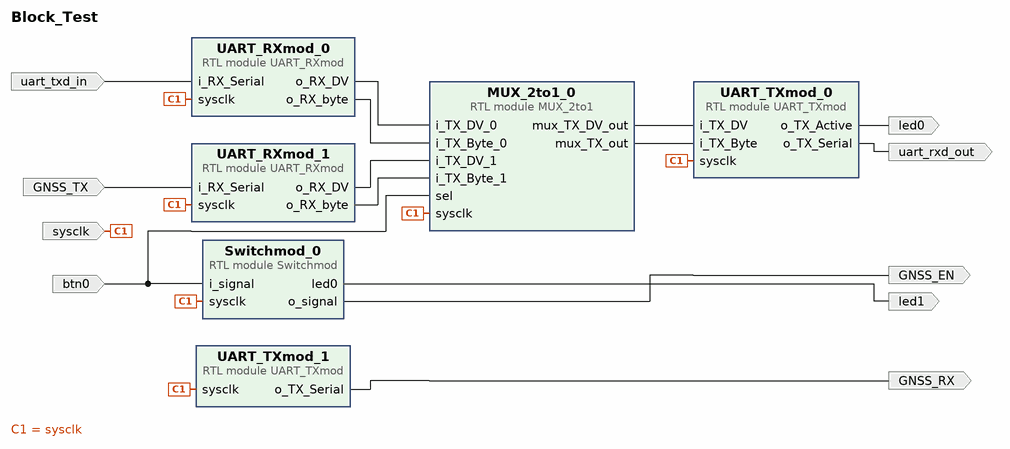
[diagram p0: block diagram of the top level]
# Vivado block design Block_Test, xc7a35tcpg236-1, Vivado 2024.2
create_bd_design Block_Test

create_bd_port -dir O led0
create_bd_port -dir O led1
create_bd_port -dir I sysclk
create_bd_port -dir I uart_txd_in
create_bd_port -dir I btn0
create_bd_port -dir O GNSS_EN
create_bd_port -dir O GNSS_RX
create_bd_port -dir I GNSS_TX
create_bd_port -dir O uart_rxd_out

create_bd_cell -type module -reference UART_RXmod UART_RXmod_0
create_bd_cell -type module -reference UART_TXmod UART_TXmod_0
create_bd_cell -type module -reference Switchmod Switchmod_0
create_bd_cell -type module -reference UART_TXmod UART_TXmod_1
create_bd_cell -type module -reference UART_RXmod UART_RXmod_1
create_bd_cell -type module -reference MUX_2to1 MUX_2to1_0

# ---- connections ----

connect_bd_net [get_bd_ports GNSS_TX] [get_bd_pins UART_RXmod_1/i_RX_Serial]
connect_bd_net [get_bd_pins MUX_2to1_0/mux_TX_DV_out] [get_bd_pins UART_TXmod_0/i_TX_DV]
connect_bd_net -net MUX_2to1_0_mux_TX_signal_out [get_bd_pins MUX_2to1_0/mux_TX_out] [get_bd_pins UART_TXmod_0/i_TX_Byte]
connect_bd_net [get_bd_pins Switchmod_0/led0] [get_bd_ports led1]
connect_bd_net [get_bd_pins Switchmod_0/o_signal] [get_bd_ports GNSS_EN]
connect_bd_net [get_bd_pins UART_RXmod_0/o_RX_DV] [get_bd_pins MUX_2to1_0/i_TX_DV_0]
connect_bd_net [get_bd_pins UART_RXmod_0/o_RX_byte] [get_bd_pins MUX_2to1_0/i_TX_Byte_0]
connect_bd_net [get_bd_pins UART_RXmod_1/o_RX_DV] [get_bd_pins MUX_2to1_0/i_TX_DV_1]
connect_bd_net [get_bd_pins UART_RXmod_1/o_RX_byte] [get_bd_pins MUX_2to1_0/i_TX_Byte_1]
connect_bd_net [get_bd_pins UART_TXmod_0/o_TX_Active] [get_bd_ports led0]
connect_bd_net [get_bd_pins UART_TXmod_0/o_TX_Serial] [get_bd_ports uart_rxd_out]
connect_bd_net [get_bd_pins UART_TXmod_1/o_TX_Serial] [get_bd_ports GNSS_RX]
connect_bd_net -net btn0_1 [get_bd_ports btn0] [get_bd_pins Switchmod_0/i_signal] [get_bd_pins MUX_2to1_0/sel]
connect_bd_net [get_bd_ports sysclk] \
  [get_bd_pins UART_RXmod_0/sysclk] [get_bd_pins UART_TXmod_0/sysclk] [get_bd_pins UART_RXmod_1/sysclk] \
  [get_bd_pins Switchmod_0/sysclk] [get_bd_pins UART_TXmod_1/sysclk] [get_bd_pins MUX_2to1_0/sysclk]
connect_bd_net [get_bd_ports uart_txd_in] [get_bd_pins UART_RXmod_0/i_RX_Serial]

validate_bd_design
save_bd_design
